# EAGLE design V1 (EAGLE 9.4.2)
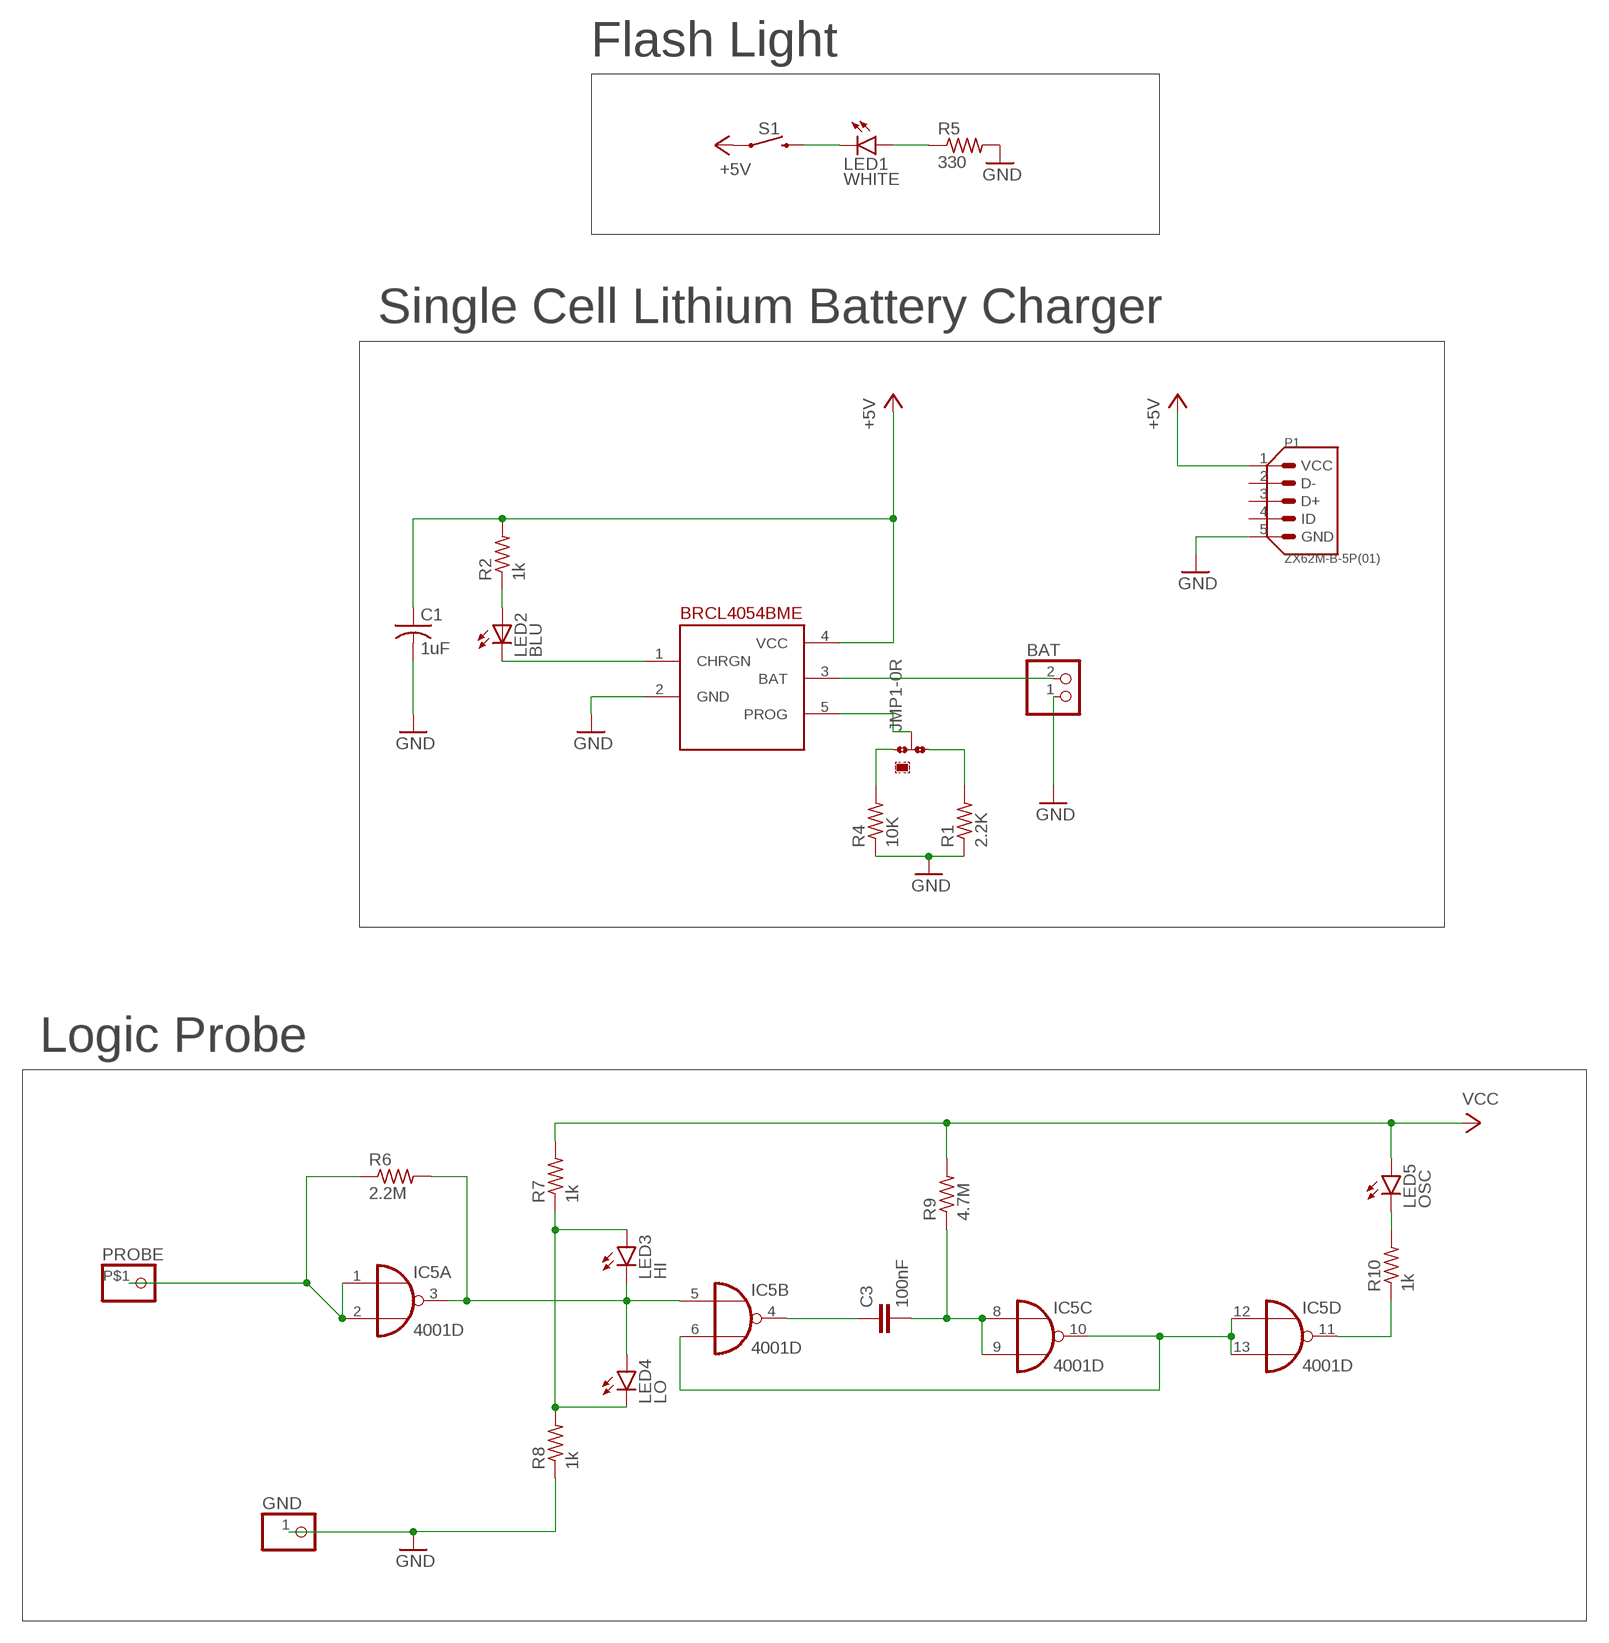
[diagram p0: schematic, sheet 1, part 1 of 2]
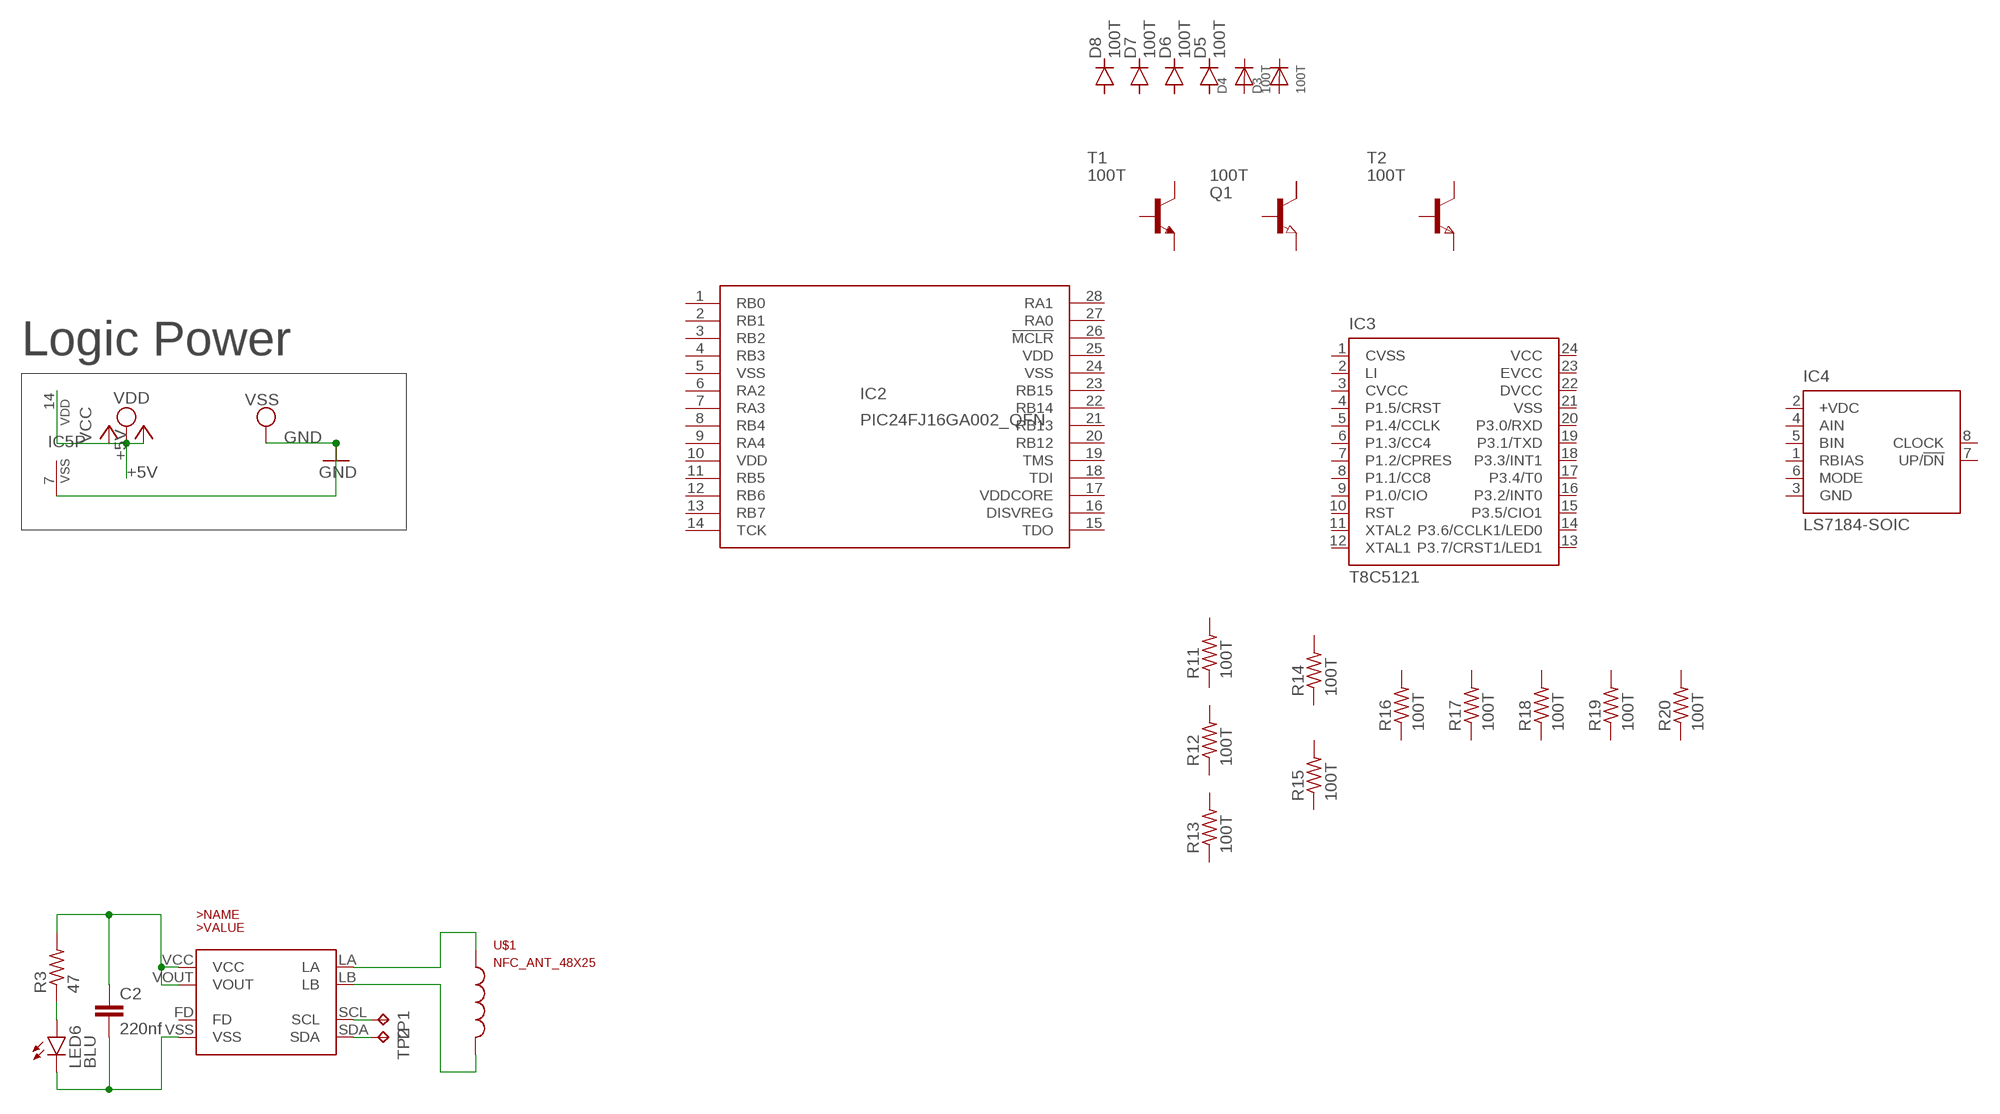
[diagram p1: schematic, sheet 1, part 2 of 2]

## Parts
BAT  JST_2PIN-SMT  [JST-PH-2-SMT]
C1  1uF  C-USC0402  [C0402]
C2  220nf  C-EUC0402  [C0402]
C3  100nF  C-EUC0402  [C0402]
D3  100T  DIODESMA  [SMADIODE]
D4  100T  DIODESOD-123  [SOD-123]
D5  100T  DIODE-SOD80C  [SOD80C]
D6  100T  DIODE-SOD323-R  [SOD323-R]
D7  100T  DIODE-MICROMELF-R  [MICROMELF-R]
D8  100T  DIODE-SC79_INFINEON  [SC79_INFINEON]
GND  PINHD-1X1  [1X01]
IC2  PIC24FJ16GA002_QFN  [QFN28-ML_6X6MM]
IC3  T8C5121  [SSOP24]
IC4  LS7184-SOIC  [SOIC08]
IC5  4001D  [SO14]
JMP1  0R-JUMPA  [A0R-JMP]
LED1  WHITE  LED3MM  [LED3MM]
LED2  BLU  LEDCHIP-LED0603  [CHIP-LED0603]
LED3  HI  LEDSML0603  [SML0603]
LED4  LO  LEDSML0603  [SML0603]
LED5  OSC  LEDSML0603  [SML0603]
LED6  BLU  LEDSML0603  [SML0603]
NT3H1101  NT3H1101  [XQFN8]
P1  ZX62M-B-5P(01)  [HRS_ZX62M-B-5P(01)]
PROBE  PINHD-1X1-BIGPOGO  [1X1-BIGPOGO]
Q1  100T  NPN-TRANSISTIOR-2COLSOT89  [SOT89]
R1  2.2K  R-US_R0402  [R0402]
R2  1k  R-US_R0402  [R0402]
R3  47  R-US_R0402  [R0402]
R4  10K  R-US_R0402  [R0402]
R5  330  R-US_R0402  [R0402]
R6  2.2M  R-US_R0402  [R0402]
R7  1k  R-US_R0402  [R0402]
R8  1k  R-US_R0402  [R0402]
R9  4.7M  R-US_R0402  [R0402]
R10  1k  R-US_R0402  [R0402]
R11  100T  R-US_R0201  [R0201]
R12  100T  R-US_R0201  [R0201]
R13  100T  R-US_R0201  [R0201]
R14  100T  R-US_R0402  [R0402]
R15  100T  R-US_R0402  [R0402]
R16  100T  R-US_R0603  [R0603]
R17  100T  R-US_R0805  [R0805]
R18  100T  R-US_R1206  [R1206]
R19  100T  R-US_R1210  [R1210]
R20  100T  R-US_R2010  [R2010]
S1  MOMENTARY-SWITCH-SPST-SMD-5.2-REDUNDANT  [TACTILE_SWITCH_SMD_5.2MM]
T1  100T  -NPN-SOT23-EBC  [SOT23-EBC]
T2  100T  NPNSOT223  [SOT223]
TP1  TPTP06R  [TP06R]
TP2  TPTP06R  [TP06R]
U$1  NFC_ANT_48X25  [NFC_ANT_48X25]
U$3  HX4054A  [SOT23-5L]

## Nets
+5V: C1.1 IC5.14(P:VDD) P1.1(VCC) R2.2 S1.1 S1.2 U$3.4(VCC) ; supply symbol labelled VCC, VDD
GND: BAT.1 C1.2 GND.1 IC5.7(P:VSS) P1.5(GND) R1.1 R4.1 R5.2 R8.1 U$3.2(GND) ; supply symbol labelled VSS
N$1: IC5.9(C:I1)
N$2: JMP1.3 R1.2
N$3: LED2.A R2.1
N$4: LED2.C U$3.1(CHRGN)
N$5: BAT.2 U$3.3(BAT)
N$6: JMP1.2 U$3.5(PROG)
N$7: LED1.A R5.1
N$8: IC5.6(B:I1) IC5.10(C:O) IC5.12(D:I0) IC5.13(D:I1)
N$9: IC5.1(A:I0) IC5.2(A:I1) PROBE.P$1 R6.1
N$10: LED3.A LED4.C R7.1 R8.2
N$11: C3.2 IC5.8(C:I0) R9.1
N$12: NT3H1101.LA U$1.A
N$13: NT3H1101.LB U$1.B U$1.P$3(B)
N$14: C2.1 NT3H1101.VCC NT3H1101.VOUT R3.2
N$15: LED6.A R3.1
N$16: C2.2 LED6.C NT3H1101.VSS
N$17: IC5.3(A:O) IC5.5(B:I0) LED3.C LED4.A R6.2
N$18: NT3H1101.SDA TP2.TP
N$19: NT3H1101.SCL TP1.TP
N$20: C3.1 IC5.4(B:O)
N$21: IC5.11(D:O) R10.1
N$22: LED5.C R10.2
N$24: JMP1.1 R4.2
N$25: LED1.K(C) S1.3 S1.4
VCC: LED5.A R7.2 R9.2
Unconnected: D3.A D3.C D4.A D4.C D5.A D5.C D6.A D6.C D7.A D7.C D8.A D8.C IC2.1(RB0) IC2.2(RB1) IC2.3(RB2) IC2.4(RB3) IC2.6(RA2) IC2.7(RA3) IC2.8(RB4) IC2.9(RA4) IC2.11(RB5) IC2.12(RB6) IC2.13(RB7) IC2.14(TCK) IC2.15(TDO) IC2.16(DISVREG) IC2.18(TDI) IC2.19(TMS) IC2.20(RB12) IC2.21(RB13) IC2.22(RB14) IC2.23(RB15) IC2.26(!MCLR) IC2.27(RA0) IC2.28(RA1) IC3.4(P1.5/CRST) IC3.5(P1.4/CCLK) IC3.6(P1.3/CC4) IC3.7(P1.2/CPRES) IC3.8(P1.1/CC8) IC3.9(P1.0/CIO) IC3.10(RST) IC3.11(XTAL2) IC3.12(XTAL1) IC3.13(P3.7/CRST1/LED1) IC3.14(P3.6/CCLK1/LED0) IC3.15(P3.5/CIO1) IC3.16(P3.2/INT0) IC3.17(P3.4/T0) IC3.18(P3.3/INT1) IC3.19(P3.1/TXD) IC3.20(P3.0/RXD) IC3.23(EVCC) IC4.1(RBIAS) IC4.2(+VDC) IC4.4(AIN) IC4.5(BIN) IC4.6(MODE) IC4.7(UP/!DN) IC4.8(CLOCK) NT3H1101.FD P1.2(D-) P1.3(D+) P1.4(ID) Q1.1(B) Q1.2(C) Q1.2@1(C/) Q1.3(E) R11.1 R11.2 R12.1 R12.2 R13.1 R13.2 R14.1 R14.2 R15.1 R15.2 R16.1 R16.2 R17.1 R17.2 R18.1 R18.2 R19.1 R19.2 R20.1 R20.2 T1.B T1.C T1.E T2.1(B) T2.2(C) T2.3(E) T2.4(C)

## Notes on the sheet
- Flash Light
- Single Cell Lithium Battery Charger
- Logic Power
- Logic Probe

## Power pins joined to a net without a drawn wire
+5V: IC2.10(VDD) IC2.25(VDD) IC3.24(VCC)
CVCC: IC3.3(CVCC)
CVSS: IC3.1(CVSS)
DVCC: IC3.22(DVCC)
GND: IC2.5(VSS) IC2.24(VSS) IC3.21(VSS) IC4.3(GND)
LI: IC3.2(LI)
VDDCORE: IC2.17(VDDCORE)

## Library data of the parts
BAT = adafruit:JST_2PIN: JST 2-Pin Connectors of various flavors SMT-RA (S2B-PH-SM4) 4UConnector #17311 SMT (B2B-PH-SM4) THM-RA (S2B-PH) THM (B2B-PH)
C1 = adafruit:C-US: CAPACITOR, American symbol
C2 C3 = resistor:C-EU: CAPACITOR, European symbol
D3 D4 = adafruit:DIODE: Diode SMADIODE - SMA Surface Mount Package 20V 1A Schottky Diode Digikey: 641-1014-6-ND DO-1N4148 - Through Hole Small Current Diode SOD-123 20V 1 A (.5mV Vf) Schottky Diode - Digikey: MBRX120TPMSCT-ND SOD-323 10V 570mA (.38mV Vf, 3ns) Schottky Diode - Digikey: ZLLS410CT-ND SOD-523 30V 30mA Schottky Diode (RB751S-40TE61) - Digikey: RB751S-40TE61CT-ND SOT23-R/W - SOT23 Package (R = Solder Paste/Reflow Ovens, W = Hand-Soldering) BAT54Film 40V 300mA - Digikey: 497-7162-1-ND
D5-D8 = diode:DIODE-: DIODE
GND PROBE = adafruit:PINHD-1X1: Pin header 1x1 for 0.1" spacing With round pins
IC2 = microchip:PIC24FJ16GA002_QFN: PIC24FJ16GA002_QFN edit this description Auto generated by make-symbol-device-package-bsdl.ulp Rev. 25 Source: PIC24FJ16GA002_QFN.bsd; MPN: PIC24FJ16GA002-I/ML; OC_FARNELL: unknown; OC_NEWARK: 40M1425
IC3 = atmel:T8*C5121: 8-bit Microcontroller with Multiprotocol Smart Card Interface Source: Uploaded by Heiko Künzel <heiko.kuenzel@atg-gera.de> from ATG Automatisierungstechnik Gera Mon Mar 10 13:32:48 2003 Atmel-Library mit zusätzlich T83C5121-Prozessor im SSOP24-Package.; OC_FARNELL: unknown; OC_NEWARK: unknown
IC4 = optocoupler:LS7184: Encoder to Counter Interface Source: http://www.usdigital.com/products/ls7183-ls7184/ls7183 ls7184 Data Sheet.pdf; OC_FARNELL: unknown; OC_NEWARK: unknown
IC5 = 40xx:4001: Quad 2-input NOR
JMP1 = jump-0r-smd:0R-JUMP: SMD 0R 0805 Jumper
LED1 LED3-LED6 = led:LED: LED
LED2 = adafruit:LED: LED
NT3H1101 = business_card:NT3H1101
P1 = ZX62M-B-5P_01_:ZX62M-B-5P(01): Conn Micro USB 2.0 Type B RCP 5 POS 0.65mm Solder RA SMD 5 Terminal 1 Port T/R; AVAILABILITY: Unavailable; DESCRIPTION: Conn Rcpt Micro Usb b Mid Mnt; MF: Hirose; MP: ZX62M-B-5P; PACKAGE: None; PRICE: None
Q1 = semicon-smd-ipc:NPN-TRANSISTIOR-2COL: NPN TRANSISTOR 2 colletor pins
R1-R20 = rcl:R-US_: RESISTOR, American symbol; SPICEPREFIX: R
S1 = SparkFun-Switches:MOMENTARY-SWITCH-SPST: Momentary Switch (Pushbutton) - SPST Normally-open (NO) SPST momentary switches (buttons, pushbuttons). Variants PTH-12MM - 12mm square, through-hole Momentary Pushbutton Switch - 12mm Square <https://www.sparkfun.com/products/9190> (COM-09190) PTH-6.0MM, PTH-6.0MM-KIT - 6.0mm square, through-hole Mini Pushbutton Switch <https://www.sparkfun.com/products/97> (COM-00097) KIT package intended for soldering kit's - only one side of pads' copper is exposed. PTH-RIGHT-ANGLE-KIT - Right-angle, through-hole Right Angle Tactile Button <https://www.sparkfun.com/products/10791> - Used on SparkFun BigTime Watch Kit <https://www.sparkfun.com/products/11734> SMD-12MM - 12mm square, surface-mount Tactile Button - SMD (12mm) <https://www.sparkfun.com/products/12993> (COM-12993) Used on SparkFun PicoBoard <https://www.sparkfun.com/products/11888> SMD-4.5MM - 4.5mm Square Trackball Switch Used on SparkFun Blackberry Trackballer Breakout <https://www.sparkfun.com/products/13169> SMD-4.6MMX2.8MM - 4.60mm x 2.80mm, surface mount Used on SparkFun SAMD21 Mini Breakout <https://www.sparkfun.com/products/13664> SMD-5.2MM, SMD-5.2-REDUNDANT - 5.2mm square, surface-mount Mini Pushbutton Switch - SMD <https://www.sparkfun.com/products/8720> (COM-08720) Used on Arduino Pro Mini <https://www.sparkfun.com/products/11114> REDUNDANT package connects both switch circuits together SMD-6.0X3.5MM - 6.0 x 3.5mm, surface mount Momentary Reset Switch SMD <https://www.sparkfun.com/products/8229> (COM-08229) SMD-6.2MM-TALL - 6.2mm square, surface mount Tactile Button - SMD (6mm) <https://www.sparkfun.com/products/12992> Used on SparkFun Digital Sandbox <https://www.sparkfun.com/products/12651> SMD-RIGHT-ANGLE - Right-angle, surface mount Used on SparkFun Block for Intel® Edison - Arduino <https://www.sparkfun.com/products/13036>; PROD_ID: SWCH-08247; SF_SKU: COM-08720
T1 = transistor:*-NPN-: NPN Transistror BF959 corrected 2008.03.06
T2 = zetex:NPNSOT223: NPN TRANSISTOR; MPN: DJT4031N-13; OC_FARNELL: 1710672; OC_NEWARK: 25R4490
TP1 TP2 = testpad:TP: Test pad
U$1 = business_card:NFC_ANT_48X25
U$3 = BuisinessCard:HX4054A

## Board
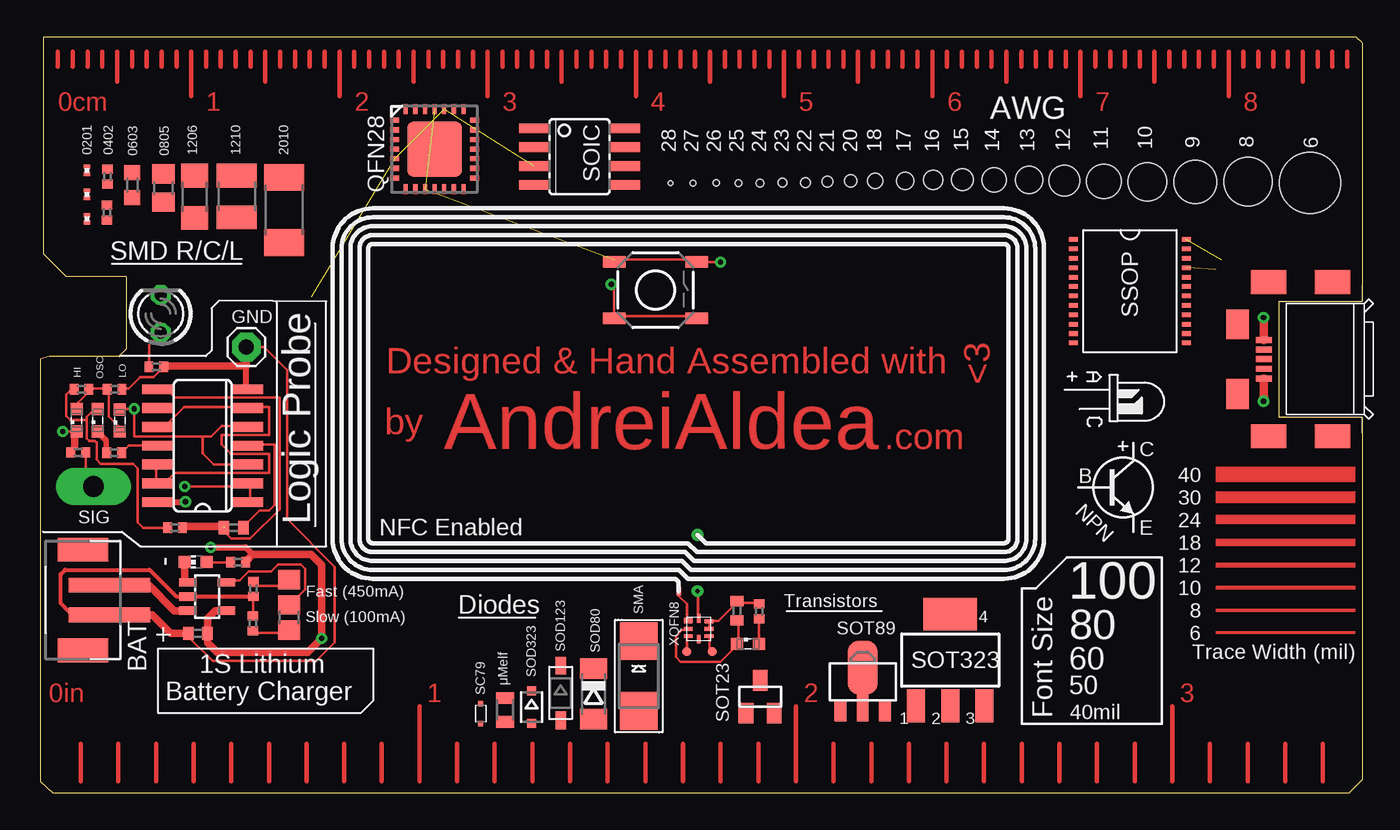
[diagram p2: board, top side]
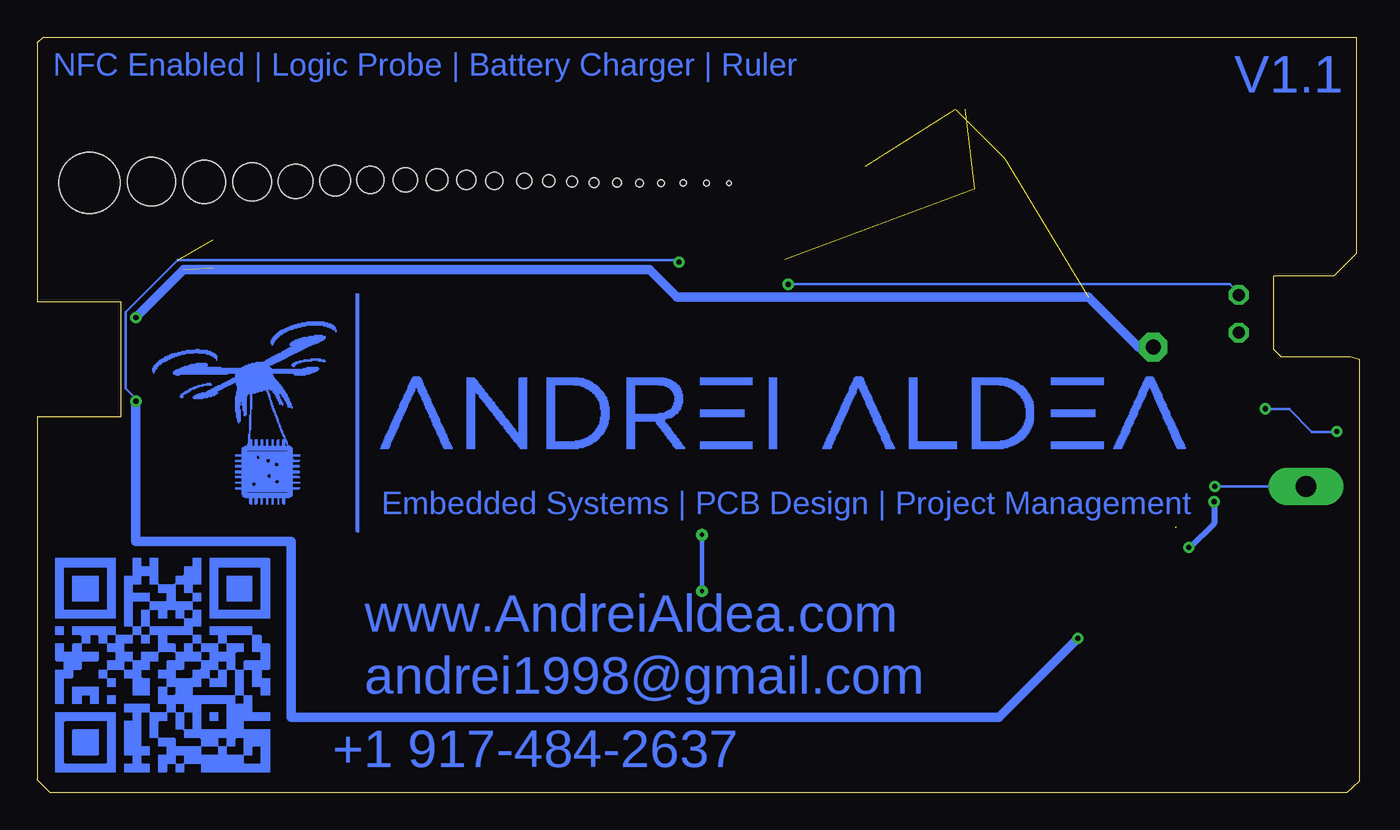
[diagram p3: board, bottom side, seen from below]

Size 89.23 x 51 mm. Coordinates in mm from the lower left corner, seen from the top.
Outline: 0.03,29.26 0,0.76 0.84,0 88.34,0 89.21,0.86 89.2,25.36 83.6,25.36 83.6,33.16 89.23,33.15 89.21,50.62 88.83,51 0.2,51 0.2,36.4 1.73,34.87 5.77,34.87 5.82,34.82 5.82,29.95 5.31,29.44 0.61,29.44 0.03,29.26
Copper layers (1*16): Top 0.035mm / dielectric 1.5mm / Bottom 0.035mm
Design rules "default *": minimum track width 6mil, minimum drill 0.35mm, track to track 6mil, track to pad 6mil, pad to pad 6mil, via to via 6mil, smd to smd 6mil, copper to edge 40mil, drill to drill 6mil, minimum pad ring 10mil, minimum via ring 8mil, stop-mask expansion 4mil, vias tented up to drill 25mil, thermal gap 10mil
Holes 3.25 mm at 81.52,41.24
Holes 2.9 mm at 77.95,41.21
Holes 2.59 mm at 74.71,41.22
Holes 2.3 mm at 71.78,41.25
Holes 2.05 mm at 69.13,41.31
Holes 1.83 mm at 66.73,41.36
Holes 1.63 mm at 64.39,41.36
Holes 1.45 mm at 62.23,41.39
Holes 1.29 mm at 60.26,41.36
Holes 1.15 mm at 58.37,41.3
Holes 1.02 mm at 56.36,41.3
Holes 0.81 mm at 54.69,41.3
Holes 0.72 mm at 53.14,41.24
Holes 0.64 mm at 51.64,41.17
Holes 0.57 mm at 50.1,41.17
Holes 0.51 mm at 48.58,41.15
Holes 0.45 mm at 47.13,41.15
Holes 0.32 mm at 42.53,41.14
Holes 0.36 mm at 44.07,41.14
Holes 0.4 mm at 45.63,41.16
Holes 4.11 mm at 85.7,41.15

### Footprints (pad centres in the part's own frame; a part is rotated, then mirrored left to right if it is on the bottom)
JST-PH-2-SMT = smd 1 x 5.5: 1 -1,-1.8; 2 1,-1.8 | smd 1.6 x 3.4: NC1 -3.4,0; NC2 3.4,0
C0402 = smd 0.7 x 0.9: 1 -0.65,0; 2 0.65,0
SMADIODE = smd 2.54 x 2.54: A 2.349,0; C -2.349,0
SOD-123 = smd 1.2 x 0.7: A 1.85,0; C -1.85,0
SOD80C = smd 1.4 x 1.8: A 1.7,0; C -1.7,0
SOD323-R = smd 0.6 x 0.6: A 1.1,0; C -1.1,0
MICROMELF-R = smd 0.8 x 1.2: A 0.8,0; C -0.8,0
SC79_INFINEON = smd 0.35 x 0.35: A 0.675,0; C -0.675,0
1X01 = drill 1.016 pad 1.93 octagon: 1 0,0
QFN28-ML_6X6MM = smd 0.7 x 0.35: 1 -2.7,1.95; 2 -2.7,1.3; 3 -2.7,0.65; 4 -2.7,0; 5 -2.7,-0.65; 6 -2.7,-1.3; 7 -2.7,-1.95; 15 2.7,-1.95; 16 2.7,-1.3; 17 2.7,-0.65; 18 2.7,0; 19 2.7,0.65; 20 2.7,1.3; 21 2.7,1.95 | smd 0.35 x 0.7: 8 -1.95,-2.7; 9 -1.3,-2.7; 10 -0.65,-2.7; 11 0,-2.7; 12 0.65,-2.7; 13 1.3,-2.7; 14 1.95,-2.7; 22 1.95,2.7; 23 1.3,2.7; 24 0.65,2.7; 25 0,2.7; 26 -0.65,2.7; 27 -1.3,2.7; 28 -1.95,2.7 | smd 3.7 x 3.7: EXP 0,0
SSOP24 = smd 0.305 x 0.61: 1 -3.493,-3.81; 2 -2.857,-3.81; 3 -2.223,-3.81; 4 -1.587,-3.81; 5 -0.953,-3.81; 6 -0.318,-3.81; 7 0.318,-3.81; 8 0.953,-3.81; 9 1.587,-3.81; 10 2.223,-3.81; 11 2.857,-3.81; 12 3.493,-3.81; 13 3.493,3.81; 14 2.857,3.81; 15 2.223,3.81; 16 1.587,3.81; 17 0.953,3.81; 18 0.318,3.81; 19 -0.318,3.81; 20 -0.953,3.81; 21 -1.587,3.81; 22 -2.223,3.81; 23 -2.857,3.81; 24 -3.493,3.81
SOIC08 = smd 0.66 x 2.032: 1 -1.905,-3.073; 2 -0.635,-3.073; 3 0.635,-3.073; 4 1.905,-3.073; 5 1.905,3.073; 6 0.635,3.073; 7 -0.635,3.073; 8 -1.905,3.073
SO14 = smd 0.66 x 2.032: 1 -3.81,-3.073; 2 -2.54,-3.073; 3 -1.27,-3.073; 4 0,-3.073; 5 1.27,-3.073; 6 2.54,-3.073; 7 3.81,-3.073; 8 3.81,3.073; 9 2.54,3.073; 10 1.27,3.073; 11 0,3.073; 12 -1.27,3.073; 13 -2.54,3.073; 14 -3.81,3.073
A0R-JMP = smd 1.5 x 1.3: 1 0,1.7; 2 0,0; 3 0,-1.7
LED3MM = drill 0.813 octagon: A -1.27,0; K 1.27,0
CHIP-LED0603 = smd 0.8 x 0.8: A 0,-0.75; C 0,0.75
SML0603 = smd 0.8 x 0.8: A 0.75,0; C -0.75,0
XQFN8 = smd 0.25 x 0.6: FD 0,-0.7; LB 0,0.7 | smd 0.6 x 0.35: LA -0.7,0.55 | smd 0.6 x 0.25: SCL -0.7,-0.5; SDA 0.7,-0.5; VCC 0.7,0; VOUT 0.7,0.5; VSS -0.7,0
HRS_ZX62M-B-5P(01) = smd 0.4 x 1.05: 1 -1.3,3.355; 2 -0.65,3.355; 3 0,3.355; 4 0.65,3.355; 5 1.3,3.355 | smd 1.6 x 2.4: S1 5.2,-1.27; S2 -5.2,-1.27; S3 -5.2,3.03; S6 5.2,3.03 | smd 2 x 1.5: S4 -2.35,5.13; S5 2.35,5.13
1X1-BIGPOGO = drill 1.4 pad 2.54 long: P$1 0,0
SOT89 = smd 0.8 x 1.4: 1 -1.499,-1.981; 3 1.499,-1.981 | smd 0.8 x 1.9: 2 0,-1.727 | smd 2.032 x 3.65: 2@1 0,0.94
R0402 = smd 0.6 x 0.7: 1 -0.5,0; 2 0.5,0
R0201 = smd 0.28 x 0.43: 1 -0.255,0; 2 0.255,0
R0603 = smd 1 x 1.1: 1 -0.85,0; 2 0.85,0
R0805 = smd 1.3 x 1.5: 1 -0.95,0; 2 0.95,0
R1206 = smd 1.6 x 1.803: 1 -1.422,0; 2 1.422,0
R1210 = smd 1.6 x 2.7: 1 -1.4,0; 2 1.4,0
R2010 = smd 1.8 x 2.7: 1 -2.2,0; 2 2.2,0
TACTILE_SWITCH_SMD_5.2MM = smd 1.524 x 0.762: 1 -2.794,1.905; 2 2.794,1.905; 3 -2.794,-1.905; 4 2.794,-1.905
SOT23-EBC = smd 1 x 1.4: B 0.95,-1.1; C 0,1.1; E -0.95,-1.1
SOT223 = smd 1.219 x 2.235: 1 -2.311,-3.099; 2 0,-3.099; 3 2.311,-3.099 | smd 3.6 x 2.2: 4 0,3.099
TP06R = smd 0.6 x 0.6: TP 0,0
NFC_ANT_48X25 = smd 0.3 x 0.6 bottom: A -0.635,13.335; A1 -0.635,13.335; A2 -0.635,13.335 | drill 0.3 pad 0.61: B 0.635,13.335; B1 0.635,13.335; B2 0.635,13.335; P$1 0.635,9.525; P$2 0.635,9.525; P$3 0.635,9.525
SOT23-5L = smd 0.55 x 1.2: 1 -0.95,-1.3; 2 0,-1.3; 3 0.95,-1.3; 4 0.95,1.3; 5 -0.95,1.3

### Placement (x,y rotation side)
BAT  2.9,13 90 top
C1  10.66,10.76 180 top
C2  47.03,12.28 270 top
C3  13.07,17.88 180 top
D3  40.4,7.87 270 top
D4  35.13,6.73 270 top
D5  37.35,6.67 270 top
D6  33.16,5.78 270 top
D7  31.38,5.59 270 top
D8  29.73,5.33 270 top
E$54  [NPN-SYMB]  73.08,20.6 0 top
E$74  [LED-GUIDE]  72.14,26.09 270 top
GND  13.92,30.07 0 top
IC2  26.62,43.43 0 top
IC3  73.55,33.85 270 top
IC4  36.4,42.93 270 top
IC5  10.97,23.42 90 top
JMP1  16.82,12.67 180 top
LED1  8.14,32.32 90 top
LED2  10.5,15.57 90 top
LED3  2.46,25.13 90 top
LED4  5.39,25.11 90 top
LED5  3.89,25.13 90 top
LED6  47.77,10.05 0 top
NT3H1101  44.44,11.06 0 top
P1  85.93,29.26 90 top
PROBE  3.61,20.67 180 top
Q1  55.51,7.49 0 top
R1  14.39,13.75 90 top
R2  13.36,15.57 0 top
R3  48.53,12.23 90 top
R4  14.37,11.43 270 top
R5  7.85,28.75 0 top
R6  2.58,22.96 180 top
R7  2.79,27.22 180 top
R8  5.03,27.22 180 top
R9  9.11,17.88 180 top
R10  5,22.95 180 top
R11  3.17,38.73 90 top
R12  3.17,40.38 90 top
R13  3.17,42 90 top
R14  4.51,39.14 90 top
R15  4.55,41.58 90 top
R16  6.22,41.01 90 top
R17  8.32,40.8 90 top
R18  10.43,40.22 90 top
R19  13.28,40.24 90 top
R20  16.48,39.32 90 top
S1  41.53,33.92 0 top
T1  48.59,6.48 0 top
T2  61.42,8.95 0 top
TP1  43.63,9.51 0 top
TP2  45.35,9.51 0 top
U$1  43.73,26.94 180 bottom
U$2  [IMPERIAL]  0.2,3.3 0 top
U$3  11.28,13.23 270 top
U$4  [METRIC]  0.2,50 0 top

### Tracks (layer width: path | path; a pad name or v marks a point on that pad's centre or on a via)
+5V  (via drill 0.35)  (3 unrouted)
  Top 0.152: S1.1 38.76,35.97 44.25,35.97 S1.2 44.4,35.81 v45.91,35.81 | 82.35,27.74 82.57,27.74
  Top 0.406: v9.8,19.63 9.78,19.61 IC5.14 | v11.51,16.56 13.86,16.56 14.36,16.07
  Top 0.508: 14.05,15.76 R2.2 14.36,16.07 18.3,16.07 19,15.37 v19,10.41 18.05,9.46 11.95,9.46 11.31,10.11 C1.1 11.31,11.77 11.82,12.28 U$3.4
  Top 0.584: P1.1 82.57,27.74 82.57,26.68
  Top 0.635: 82.57,26.68 82.56,26.67 v82.56,26.42
  Bottom 0.152: v45.91,35.81 46.04,35.94 79.76,35.94 83.26,32.44 83.26,27.28 82.65,26.67 v82.56,26.42
  Bottom 0.406: v9.8,19.63 9.8,18.19 11.43,16.56 v11.51,16.56
  Bottom 0.635: v82.56,26.42 82.56,16.95 72.09,16.95 72.09,5.08 24.33,5.08 v19,10.41
GND  (via drill 0.35)  (4 unrouted)
  Top 0.152: R4.1 14.38,12.19 14.38,13.11 R1.1 14.22,13.26 | 10.11,13.26 U$3.2 9.96,13.26 | 2.12,12.04 4.47,12.04 BAT.1 | R8.1 5.54,27.28 5.99,27.28 6.76,28.04 7.67,28.04 8.28,28.65 R5.2 | C1.2 9.73,10.79 11.63,8.89 18.62,8.89 19.89,10.16 19.89,15.24 16.66,18.47 16.66,28.52 15.11,30.07 GND.1
  Top 0.254: 10.11,13.26 14.22,13.26 | 9.96,13.26 9.17,13.26 7.39,15.04 1.69,15.04 1.38,14.73 1.38,12.78 2.12,12.04
  Top 0.406: IC5.7 13.92,27.36 13.92,28.8
  Top 0.508: 14.39,11.95 R4.1 | 14.37,13.23 R1.1 | BAT.1 7.57,12.01 8.81,10.76 C1.2 | GND.1 13.92,28.8 8.43,28.8 R5.2
  Top 0.584: P1.5 82.57,31.99
  Top 0.635: 82.57,31.99 82.56,32 v82.56,32.07
  Bottom 0.635: GND.1 14.91,30.07 18.3,33.47 46.05,33.47 47.89,35.31 79.32,35.31 v82.56,32.07
N$2
  Top 0.152: R1.2 14.17,13.97 16.71,13.97 JMP1.3
N$3
  Top 0.152: R2.1 12.85,15.54 11.33,15.54 LED2.A
N$4
  Top 0.508: U$3.1 9.75,14.41 LED2.C
N$5
  Top 0.508: U$3.3 9.07,12.28 7.32,14.03 4.72,14.03 BAT.2
N$6
  Top 0.152: U$3.5 12.7,14.33 13.46,14.33 14.07,14.94 15.6,14.94 16.05,15.39 17.58,15.39 17.88,15.09 17.88,13.72 16.82,12.65 JMP1.2
N$7
  Top 0.152: R5.1 7.37,28.8 7.37,30.2 8.14,30.98 LED1.A
N$8
  Top 0.152: IC5.12 7.82,22.23 7.82,20.95 IC5.13 8.46,20.95 9.09,21.59 15.44,21.59 15.44,22.86 12.9,22.86 12.27,23.5 12.27,24.13 15.44,24.13 15.44,26.04 14.17,26.04 IC5.6 13.54,26.04 9.73,26.04 8.46,24.77 IC5.10
N$9  (via drill 0.35)
  Top 0.152: IC5.1 14.17,19.68 14.17,20.95 IC5.2 13.84,20.68 v9.75,20.68 | PROBE.P$1 3.08,21.2 R6.1
  Bottom 0.152: PROBE.P$1 9.72,20.67 9.73,20.68 v9.75,20.68
N$10
  Top 0.152: LED3.A 2.59,26.01 2.59,26.34 3.29,27.04 R7.1 3.4,27.28 4.47,27.28 R8.2 4.65,27.3 4.65,25.4 5.28,24.77 5.28,24.21 LED4.C
N$11  (1 unrouted)
  Top 0.152: 9.65,17.98 R9.1 | C3.2 12.27,17.78 12.9,17.14 14.17,17.14 16.15,19.13 16.15,26.67 9.09,26.67 8.46,27.3 IC5.8
  Top 0.508: 12.4,17.98 9.65,17.98
N$12
  Top 0.152: U$1.A 43.09,13.27 43.64,12.72 43.64,11.73 NT3H1101.LA
N$13
  Top 0.152: NT3H1101.LB 44.4,11.89 44.4,13.56 U$1.B
  Bottom 0.152: 44.37,17.34 44.36,17.32 U$1.B U$1.P$3
N$14
  Top 0.152: 45.16,11.58 45.16,11.12 NT3H1101.VCC | R3.2 48.51,12.8 47.14,12.8 C2.1 46.99,12.8 45.77,11.58 45.16,11.58 | 45.16,11.58 NT3H1101.VOUT
N$15
  Top 0.152: R3.1 48.51,11.58 LED6.A
N$16
  Top 0.152: NT3H1101.VSS 43.64,10.97 43.33,10.97 42.9,10.54 42.9,9.17 43.23,8.84 45.92,8.84 46.99,9.91 LED6.C 47.14,10.06 47.14,11.58 C2.2
N$17  (via drill 0.35)
  Top 0.152: 2.34,23.34 R6.2 | 2.34,24.23 LED3.C v1.53,24.38 | 10.97,24.05 11.56,24.05 12.27,24.77 13.54,24.77 IC5.5 | 10.97,24.05 6.35,24.05 v6.35,25.91 5.44,25.91 LED4.A | IC5.3 11.71,22.15 10.97,22.89 10.97,24.05
  Top 0.508: 2.34,24.23 2.34,23.34
  Bottom 0.152: v6.35,25.91 4.75,25.91 3.2,24.36 1.55,24.36 v1.53,24.38
N$18
  Top 0.152: NT3H1101.SDA 45.16,10.52 45.16,9.75 45.31,9.6 TP2.TP
N$19
  Top 0.152: TP1.TP 43.64,9.6 43.64,10.52 NT3H1101.SCL
N$20
  Top 0.152: C3.1 13.54,17.78 14.81,19.05 15.44,19.05 15.82,19.43 15.82,23.5 14.17,23.5 IC5.4
N$21
  Top 0.152: R10.1 5.97,23.42 IC5.11
N$22
  Top 0.152: 4.47,22.98 R10.2 | 3.89,24.35 LED5.C
  Top 0.381: 4.47,22.98 4.47,23.77 3.89,24.35
N$24
  Top 0.152: 14.38,10.97 R4.2 14.17,10.79 16.71,10.79 JMP1.1
N$25  (via drill 0.35)
  Top 0.152: S1.4 44.25,32.16 38.76,32.16 S1.3 38.74,34.12 v38.54,34.31
  Bottom 0.152: v38.54,34.31 8.74,34.31 8.14,33.72 LED1.K
VCC
  Top 0.152: R7.2 2.1,27.22 1.75,26.87 1.75,25.43 2.03,25.15 3.12,25.15 3.15,25.17 | LED5.A 3.73,25.76 3.56,25.76 3.15,25.35 3.15,25.17 | 3.15,25.17 3.15,23.89 3.32,23.73 3.7,23.73 3.81,23.62 3.81,22.48 4.09,22.2 6.3,22.2 6.6,21.89 6.6,18.24 6.96,17.88 R9.2
(copper drawn outside any net)
  shapes: Bottom area x3551, Top area x8

### Text on the board
Top: Designed & Hand Assembled with | <3 | by | AndreiAldea | .com
Bottom: NFC Enabled | Logic Probe | Battery Charger | Ruler | V1.1 | Embedded Systems | PCB Design | Project Management | www.AndreiAldea.com | andrei1998@gmail.com | +1 917-484-2637
tPlace: AWG | 9 | 8 | 28 | 27 | 26 | 25 | 24 | 23 | 22 | 21 | 20 | 18 | 17 | 16 | 15 | 14 | 13 | 12 | 11 | 10 | 6 | 40 | 30 | 24 | 18 | 12 | 10 | 8 | 6 | Trace Width (mil)
tNames: 0201 | 0402 | 0603 | 0805 | 1206 | 1210 | 2010 | QFN28 | SOIC | SMD R/C/L | GND | SSOP | HI | OSC | LO | SIG | Logic Probe | NFC Enabled | Fast (450mA) | Transistors | 100 | Diodes | SMA | Slow (100mA) | SOT89 | SOD123 | XQFN8 | 80 | SOD80 | 1S Lithium | SOD323 | SOT323 | 60 | SC79 | μMelf | 50 | Battery Charger | SOT23 | Font Size | 40mil
tStop: Designed & Hand Assembled with | <3 | by | AndreiAldea | .com
bStop: NFC Enabled | Logic Probe | Battery Charger | Ruler | V1.1 | Embedded Systems | PCB Design | Project Management | www.AndreiAldea.com | andrei1998@gmail.com | +1 917-484-2637